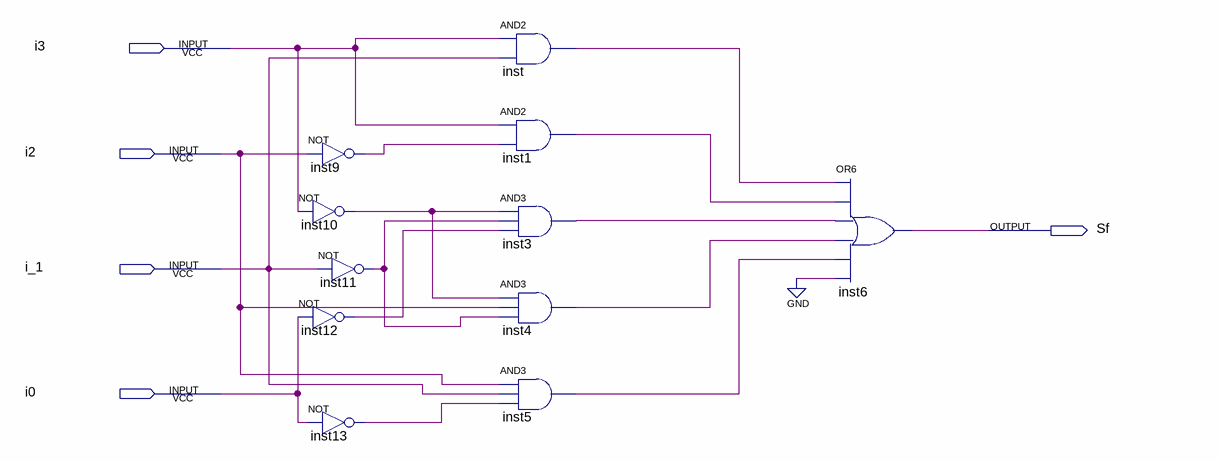
[diagram p0: schematic sheet]
// Quartus schematic lab05_f_top.bdf as structural Verilog: 11 symbols, 5 pins
module lab05_f_top (
  input  i3,
  input  i2,
  input  i_1,
  input  i0,
  output Sf
);

  wire inst1_out, inst3_out, inst4_out, inst5_out, inst9_out, inst10_out, inst11_out, inst12_out, inst13_out,
       inst_out;

  not inst9 (inst9_out, i2);
  not inst10 (inst10_out, i3);
  not inst11 (inst11_out, i_1);
  not inst12 (inst12_out, i0);
  not inst13 (inst13_out, i0);
  and inst (inst_out, i3, i_1);
  and inst1 (inst1_out, i3, inst9_out);
  and inst3 (inst3_out, inst10_out, inst11_out, inst12_out);
  and inst4 (inst4_out, inst10_out, i2, inst11_out);
  and inst5 (inst5_out, i2, i_1, inst13_out);
  or inst6 (Sf, inst_out, inst1_out, inst3_out, inst4_out, inst5_out, 1'b0);
endmodule
